# Altium project STM32 V3.1.PrjPcb
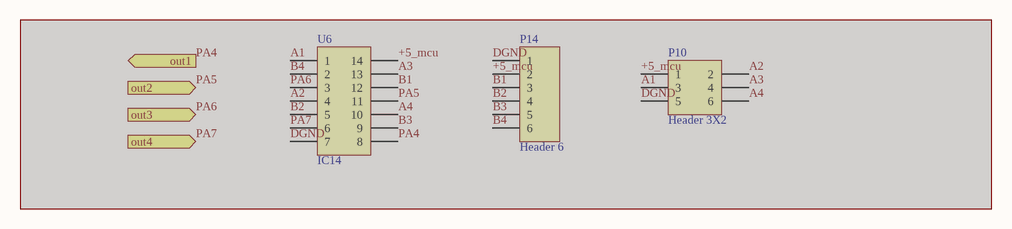
[diagram p0: Radio.SchDoc]
3 sheets, 98 parts. Net scope: hierarchical (ports join the sheet entries above them; power ports are global).
Board file: STM32 V3.1.PcbDoc
Sheets:
  Radio.SchDoc
  STM32 V3.1.SchDoc
    Designator = STLINK.SchDoc

## Sheet Radio.SchDoc
size A4

### Parts
(Parts that share a designator on the sheet are numbered #1, #2 ... from top to bottom, then left to right.)
P10#1  Header 3X2  [HDR2X3_]  (masked out: inside a compile mask, not in the netlist)
P14#1  Header 6  [HDR1X6]  (masked out: inside a compile mask, not in the netlist)
U6  IC14  [SOP_14]  (masked out: inside a compile mask, not in the netlist)

### Ports
out1 (out), out2 (out), out3 (out), out4 (out)

### Library data of the parts
P10#1 = Header 3X2: Header, 3-Pin, Dual row; LatestRevisionDate: 17-Jul-2002; LatestRevisionNote: Re-released for DXP Platform.; Publisher: Altium Limited
P14#1 = Header 6: Header, 6-Pin; LatestRevisionDate: 17-Jul-2002; LatestRevisionNote: Re-released for DXP Platform.; Publisher: Altium Limited
U6 = IC_14

## Sheet STM32 V3.1.SchDoc
size A4; Engineer: Csh; Address1: 巡游; project1: 巡游; project2: 最小系统; project3: 巡游; project4: 传感器
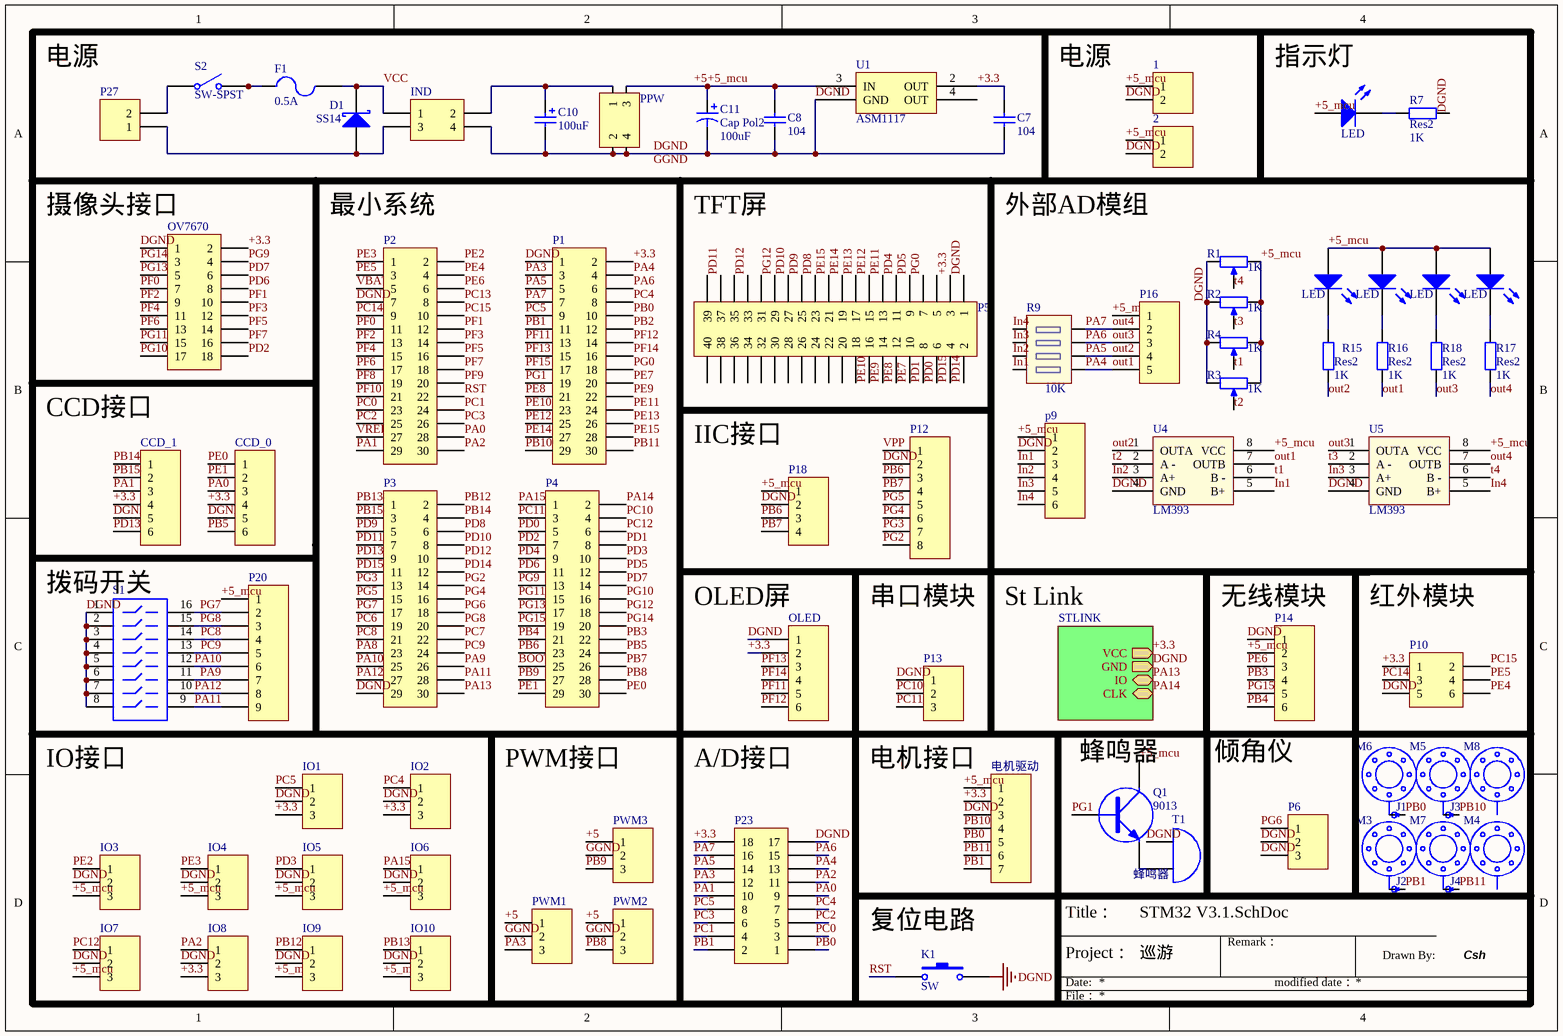
[diagram p1: STM32 V3.1.SchDoc]

### Parts
(Parts that share a designator on the sheet are numbered #1, #2 ... from top to bottom, then left to right.)
1  Header 2  [HDR1X2]  (value not drawn)
2  Header 2  [HDR1X2]  (value not drawn)
C7  value 104  [0805_cap]  (hidden comment: Cap)
C8  value 104  [0805_cap]  (hidden comment: Cap)
C10  value 100uF  [SMD-EC-F10]  (hidden comment: Cap Pol1)
C11  Cap Pol2  value 100uF  [SMD-EC-F6.3]
CCD_0  Header 6  [HDR1X6]  (value not drawn)
CCD_1  Header 6  [HDR1X6]  (value not drawn)
D1  Type: SS14  [SMA]  (hidden comment: D-Schottky)
F1  value 0.5A  [1206]  (hidden comment: Fuse)
IND  Header 2X2  [IND_R10]  (value not drawn)
IO1  Header 3  [HDR1X3]  (value not drawn)
IO2  Header 3  [HDR1X3]  (value not drawn)
IO3  Header 3  [HDR1X3]  (value not drawn)
IO4  Header 3  [HDR1X3]  (value not drawn)
IO5  Header 3  [HDR1X3]  (value not drawn)
IO6  Header 3  [HDR1X3]  (value not drawn)
IO7  Header 3  [HDR1X3]  (value not drawn)
IO8  Header 3  [HDR1X3]  (value not drawn)
IO9  Header 3  [HDR1X3]  (value not drawn)
IO10  Header 3  [HDR1X3]  (value not drawn)
J1  JUMP  [JUMP]  (value not drawn)
J2  JUMP  [JUMP]  (value not drawn)
J3  JUMP  [JUMP]  (value not drawn)
J4  JUMP  [JUMP]  (value not drawn)
K1  SW  [SW_6*6 _l]
LED1  LED  [0805_led]
LED2  LED  [0805_led]
LED3  LED  [0805_led]
LED4  LED  [0805_led]
LED5  LED  [0805_led]
M3  安装孔  [M3螺丝孔_1]  (value not drawn)
M4  安装孔  [M3螺丝孔]  (value not drawn)
M5  安装孔  [M3螺丝孔_1]  (value not drawn)
M6  安装孔  [M3螺丝孔_1]  (value not drawn)
M7  安装孔  [M3螺丝孔_1]  (value not drawn)
M8  安装孔  [M3螺丝孔]  (value not drawn)
OLED  Header 6  [HDR1X6_]  (value not drawn)
OV7670  Header 9X2  [IDC18]  (value not drawn)
P1  Header 15X2_  [HDR2X15_]  (value not drawn)
P2  Header 15X2_  [HDR2X15_]  (value not drawn)
P3  Header 15X2_  [HDR2X15_]  (value not drawn)
P4  Header 15X2_  [HDR2X15_]  (value not drawn)
P5  Header 20X2  [TFT_2.4]  (value not drawn)
P6  Header 3  (value not drawn)
p9  Header 6  [HDR1X6]  (value not drawn)
P10#2  Header 3X2  [HDR2X3_]  (value not drawn)
P12  Header 8  [HDR1X8_]  (value not drawn)
P13  Header 3  [HDR1X3_]  (value not drawn)
P14#2  Header 6  [HDR1X6]  (value not drawn)
P16  Header 5  [a05]  (value not drawn)
P18  Header 4  [HDR1X4]  (value not drawn)
P20  Header 9  [A09]  (value not drawn)
P23  Header 9X2  [JTAG_18]  (value not drawn)
P27  Header 2  [kf142r]  (value not drawn)
PPW  Header 2X2  [稳压模块]  (value not drawn)
PWM1  Header 3  [HDR1X3]  (value not drawn)
PWM2  Header 3  [HDR1X3]  (value not drawn)
PWM3  Header 3  [HDR1X3]  (value not drawn)
Q1  9013  [SOT_23_3]
R1#1  value 1K  [369-03]  (hidden comment: ResPot)
R2#1  value 1K  [369-03]  (hidden comment: ResPot)
R3  value 1K  [369-03]  (hidden comment: ResPot)
R4#1  value 1K  [369-03]  (hidden comment: ResPot)
R7  Res2  value 1K  [0805_res]
R9  10K  [0603_P]
R15  Res2  value 1K  [0805_res]
R16  Res2  value 1K  [0805_res]
R17  Res2  value 1K  [0805_res]
R18  Res2  value 1K  [0805_res]
S1  SW-DIP8  [SW_8WAY]  (value not drawn)
S2  SW-SPST  [SW-TO3]
T1  蜂鸣器  [蜂鸣器]
U1  ASM1117  [SOT_223]
U4  LM393  [SOP_8]
U5  LM393  [SOP_8]
电机驱动  Header 7  [HDR1X7]  (value not drawn)

### Sub-sheets
Designator = STLINK: VCC (out), GND (out), IO, CLK

### Nets
+3.3: C7.2 CCD_0.4 CCD_1.4 IO1.3 IO2.3 IO8.3 OLED.2 OV7670.2 P1.2 P5.3 P10#2.1 P23.18 U1.2(OUT) 电机驱动.2 ; sheet Designator/VCC
DGND: 1.2 2.2 C7.1 C8.1 C10.2 C11.2 CCD_0.5 CCD_1.5 IND.4 IO1.2 IO2.2 IO3.2 IO4.2 IO5.2 IO6.2 IO7.2 IO8.2 IO9.2 IO10.2 K1.2 OLED.1 OV7670.1 P1.1 P2.7 P3.29 P5.1 P6.2 P6.3 p9.2 P10#2.5 P12.2 P13.1 P14#2.1 P18.2 P23.17 PPW.2 PPW.4 R1#1.1(TOP) R2#1.1(TOP) R3.1(TOP) R4#1.1(TOP) R7.1 S1.1 S1.2 S1.3 S1.4 S1.5 S1.6 S1.7 S1.8 T1.2 U1.1(GND) U4.4(GND) U5.4(GND) 电机驱动.3 ; sheet Designator/GND
+5: 1.1 2.1 C8.2 C11.1 IO3.3 IO4.3 IO5.3 IO6.3 IO7.3 IO9.3 IO10.3 LED1.1 LED2.1 LED3.1 LED4.1 LED5.1 p9.1 P14#2.2 P16.1 P18.1 P20.1 PPW.3 PWM1.1 PWM2.1 PWM3.1 Q1.3(C) R1#1.2(BOT) R2#1.2(BOT) R3.2(BOT) R4#1.2(BOT) U1.3(IN) U4.8(VCC) U5.8(VCC) 电机驱动.1  [also labelled +5_mcu]
BOOT0: P4.25
GGND: PWM1.2 PWM2.2 PWM3.2
In1: p9.3 R9.4 U4.5(B+)
In2: p9.4 R9.3 U4.3(A+)
In3: p9.5 R9.2 U5.3(A+)
In4: p9.6 R9.1 U5.5(B+)
out1: P1.4 P16.5 P23.13 R9.5 R16.1 U4.7(OUTB)  [also labelled PA4]
out2: P1.5 P16.4 P23.14 R9.6 R15.1 U4.1(OUTA)  [also labelled PA5]
out3: P1.6 P16.3 P23.15 R9.7 R18.1 U5.1(OUTA)  [also labelled PA6]
out4: P1.7 P16.2 P23.16 R9.8 R17.1 U5.7(OUTB)  [also labelled PA7]
PA0: CCD_0.3 P2.28 P23.9
PA1: CCD_1.3 P2.29 P23.10
PA2: IO8.1 P2.30 P23.11
PA3: P1.3 P23.12 PWM1.3
PA8: P3.23
PA9: P3.26 P20.7 S1.11
PA10: P3.25 P20.6 S1.12
PA11: P3.28 P20.9 S1.9
PA12: P3.27 P20.8 S1.10
PA13: P3.30 ; sheet Designator/IO  [project net IO]
PA14: P4.2 ; sheet Designator/CLK  [project net CLK]
PA15: IO6.1 P4.1
PB0: J1.1 P1.10 P23.1 电机驱动.5
PB1: J2.1 P1.11 P23.2 电机驱动.7
PB2: P1.12
PB3: P4.22 P14#2.4
PB4: P4.21 P14#2.6
PB5: CCD_0.6 P4.24
PB6: P4.23 P12.3 P18.3
PB7: P4.26 P12.4 P18.4
PB8: P4.28 PWM2.3
PB9: P4.27 PWM3.3
PB10: J3.1 P1.29 电机驱动.4
PB11: J4.1 P1.30 电机驱动.6
PB12: IO9.1 P3.2
PB13: IO10.1 P3.1
PB14: CCD_1.1 P3.4
PB15: CCD_1.2 P3.3
PC0: P2.23 P23.3
PC1: P2.24 P23.4
PC2: P2.25 P23.5
PC3: P2.26 P23.6
PC4: IO2.1 P1.8 P23.7
PC5: IO1.1 P1.9 P23.8
PC6: P3.19
PC7: P3.22
PC8: P3.21 P20.4 S1.14
PC9: P3.24 P20.5 S1.13
PC10: P4.4 P13.2
PC11: P4.3 P13.3
PC12: IO7.1 P4.6
PC13: P2.8
PC14: P2.9 P10#2.3
PC15: P2.10 P10#2.2
PD0: P4.5 P5.6
PD1: P4.8 P5.8
PD2: OV7670.18 P4.7
PD3: IO5.1 P4.10
PD4: P4.9 P5.11
PD5: P4.12 P5.9
PD6: OV7670.8 P4.11
PD7: OV7670.6 P4.14
PD8: P3.6 P5.23
PD9: P3.5 P5.25
PD10: P3.8 P5.27
PD11: P3.7 P5.37
PD12: P3.10 P5.33
PD13: CCD_1.6 P3.9
PD14: P3.12 P5.2
PD15: P3.11 P5.4
PE0: CCD_0.1 P4.30
PE1: CCD_0.2 P4.29
PE2: IO3.1 P2.2
PE3: IO4.1 P2.1
PE4: P2.4 P10#2.6
PE5: P2.3 P10#2.4
PE6: P2.6 P14#2.3
PE7: P1.20 P5.10
PE8: P1.21 P5.12
PE9: P1.22 P5.14
PE10: P1.23 P5.16
PE11: P1.24 P5.13
PE12: P1.25 P5.15
PE13: P1.26 P5.17
PE14: P1.27 P5.19
PE15: P1.28 P5.21
PF0: OV7670.7 P2.11
PF1: OV7670.10 P2.12
PF2: OV7670.9 P2.13
PF3: OV7670.12 P2.14
PF4: OV7670.11 P2.15
PF5: OV7670.14 P2.16
PF6: OV7670.13 P2.17
PF7: OV7670.16 P2.18
PF8: P2.19
PF9: P2.20
PF10: P2.21
PF11: OLED.5 P1.13
PF12: OLED.6 P1.14
PF13: OLED.3 P1.15
PF14: OLED.4 P1.16
PF15: P1.17
PG0: P1.18 P5.7
PG1: P1.19 Q1.2(B)
PG2: P3.14 P12.8
PG3: P3.13 P12.7
PG4: P3.16 P12.6
PG5: P3.15 P12.5
PG6: P3.18 P6.1
PG7: P3.17 P20.2 S1.16
PG8: P3.20 P20.3 S1.15
PG9: OV7670.4 P4.13
PG10: OV7670.17 P4.16
PG11: OV7670.15 P4.15
PG12: P4.18 P5.29
PG13: OV7670.5 P4.17
PG14: OV7670.3 P4.20
PG15: P4.19 P14#2.5
RST: K1.1 P2.22
t1: R4#1.3(TAP) U4.6(B_-)
t2: R3.3(TAP) U4.2(A_-)
t3: R2#1.3(TAP) U5.2(A_-)
t4: R1#1.3(TAP) U5.6(B_-)
VBAT: P2.5
VCC: D1.2(K) F1.2 IND.1
VPP: P12.1
VREF+: P2.27
NetC10_1: C10.1 IND.2 PPW.1
NetD1_1: D1.1(A) IND.3 P27.1
NetF1_1: F1.1 S2.2(NO)
NetJ1_2: J1.2 M6.1(P)
NetJ2_2: J2.2 M3.1(P)
NetJ3_2: J3.2 M5.1(P)
NetJ4_2: J4.2 M7.1(P)
NetLED1_2: LED1.2 R7.2
NetLED2_2: LED2.2 R15.2
NetLED3_2: LED3.2 R17.2
NetLED4_2: LED4.2 R18.2
NetLED5_2: LED5.2 R16.2
NetP27_2: P27.2 S2.1(COMMON)
NetQ1_1: Q1.1(E) T1.1

Not connected (* = marked no-connect by the designer): M4 1(P); M8 1(P); P5 5 18 20 22 24 26 28 30 31 32 34 35 36 38 39 40; U1 4(OUT)

### Notes on the sheet
- 电源
- (near LED1) 指示灯
- 摄像头接口
- 最小系统
- TFT屏
- 外部AD模组
- CCD接口
- IIC接口
- (near S1) 拨码开关
- OLED屏
- (near P12) 串口模块
- St Link
- (near P14#2) 无线模块
- 红外模块
- (near S1) IO接口
- PWM接口
- A/D接口
- (near P13) 电机接口
- (near Q1) 蜂鸣器
- (near P14#2) 倾角仪
- (near K1) 复位电路
- Labels drawn without touching a wire or pin: GGND
- Title：
- Date:
- Project：
- Remark：
- modified date：
- Drawn By:
- File：

### Library data of the parts
1 2 P27 = Header 2: Header, 2-Pin; LatestRevisionDate: 17-Jul-2002; LatestRevisionNote: Re-released for DXP Platform.; Publisher: Altium Limited
C7 C8 = Cap: 无极性电容; Published: 8-Jun-2000; LatestRevisionDate: 17-Jul-2002; LatestRevisionNote: Re-released for DXP Platform.; PackageReference: RAD-0.3; Publisher: Altium Limited
C10 = Cap Pol1: Polarized Capacitor (Radial); Published: 8-Jun-2000; Revision: July-2002: Re-released for DXP Platform.; Publisher: Altium Limited
C11 = Cap Pol2: Polarized Capacitor (Axial); Published: 8-Jun-2000; Revision: July-2002: Re-released for DXP Platform.; Publisher: Altium Limited
CCD_0 CCD_1 OLED p9 P14#2 = Header 6: Header, 6-Pin; Publisher: Altium Limited
  CCD_0 CCD_1 P14#2: LatestRevisionDate: 17-Jul-2002; LatestRevisionNote: Re-released for DXP Platform.
  OLED p9: Revision: 17-Jul-2002: Re-released for DXP Platform.
D1 = D-Schottky: 肖特基二极管; Published: 8-Jun-2000; LatestRevisionDate: 17-Jul-2002; LatestRevisionNote: Re-released for DXP Platform.; PackageReference: SMB; Publisher: Altium Limited; Code_JEDEC: DO-214-AA
F1 = Fuse 2: 保险丝; Published: 8-Jun-2000; LatestRevisionDate: 17-Jul-2002; LatestRevisionNote: Re-released for DXP Platform.; PackageReference: PIN-W2/E2.8; Publisher: Altium Limited
IND PPW = Header 2X2: Header, 2-Pin, Dual row; LatestRevisionDate: 17-Jul-2002; LatestRevisionNote: Re-released for DXP Platform.; Publisher: Altium Limited
IO1-IO10 P6 P13 PWM1-PWM3 = Header 3: Header, 3-Pin; LatestRevisionDate: 17-Jul-2002; LatestRevisionNote: Re-released for DXP Platform.; Publisher: Altium Limited
LED1-LED5 = 发光二极管
M3-M8 = 安装孔: 螺丝固定孔
OV7670 P23 = Header 9X2: Header, 9-Pin, Dual row; LatestRevisionDate: 17-Jul-2002; LatestRevisionNote: Re-released for DXP Platform.; Publisher: Altium Limited
P1-P4 = Header 15X2: Header, 15-Pin, Dual row; LatestRevisionDate: 17-Jul-2002; LatestRevisionNote: Re-released for DXP Platform.; Publisher: Altium Limited
P5 = Header 20X2: Header, 20-Pin, Dual row; LatestRevisionDate: 17-Jul-2002; LatestRevisionNote: Re-released for DXP Platform.; Publisher: Altium Limited
P10#2 = Header 3X2: Header, 3-Pin, Dual row; LatestRevisionDate: 17-Jul-2002; LatestRevisionNote: Re-released for DXP Platform.; Publisher: Altium Limited
P12 = Header 8: Header, 8-Pin; LatestRevisionDate: 17-Jul-2002; LatestRevisionNote: Re-released for DXP Platform.; Publisher: Altium Limited
P16 = Header 5: Header, 5-Pin; LatestRevisionDate: 17-Jul-2002; LatestRevisionNote: Re-released for DXP Platform.; Publisher: Altium Limited
P18 = Header 4: Header, 4-Pin; LatestRevisionDate: 17-Jul-2002; LatestRevisionNote: Re-released for DXP Platform.; Publisher: Altium Limited
P20 = Header 9: Header, 9-Pin; LatestRevisionDate: 17-Jul-2002; LatestRevisionNote: Re-released for DXP Platform.; Publisher: Altium Limited
Q1 = NPN9013: pin to pad: 1>2 2>1
R1#1 R2#1 R3 R4#1 = ResPot: Potentiometer; Sim Note: Enter the Resistance value and the set point into parameter fields.; Set Position: 0.5; Published: 8-Jun-2000; LatestRevisionDate: 17-Jul-2002; LatestRevisionNote: Re-released for DXP Platform.; PackageReference: VR5; Publisher: Altium Limited
R7 R15-R18 = Res2: Resistor; Published: 8-Jun-2000; LatestRevisionDate: 17-Jul-2002; LatestRevisionNote: Re-released for DXP Platform.; PackageReference: AXIAL-0.4; Publisher: Altium Limited
R9 = 0603_P
S1 = SW-DIP8: 4009 Series DIP Switch, Raised actuator; Published: 24-Mar-1999; LatestRevisionDate: 17-Dec-2003; LatestRevisionNote: PCB Footprint replaced.; PackageReference: DIP-16-KEY; Publisher: Altium Limited; ComponentLink1Description: Manufacturer Link; ComponentLink1URL: http://www.oupiin.com/prodindx.html#Headers
S2 = SW-SPST: Single-Pole, Single-Throw Switch; pin to pad: 1>2 2>1; Published: 24-Mar-1999; Revision: July-2002: Re-released for DXP Platform.; Publisher: Altium Limited
U1 = ASM1117: 3.3V稳压芯片
电机驱动 = Header 7: Header, 7-Pin; LatestRevisionDate: 17-Jul-2002; LatestRevisionNote: Re-released for DXP Platform.; Publisher: Altium Limited

## Sheet STLINK.SchDoc
size A4; Engineer: Csh; Address1: 巡游; project1: 巡游; project2: 最小系统; project3: 巡游; project4: 传感器
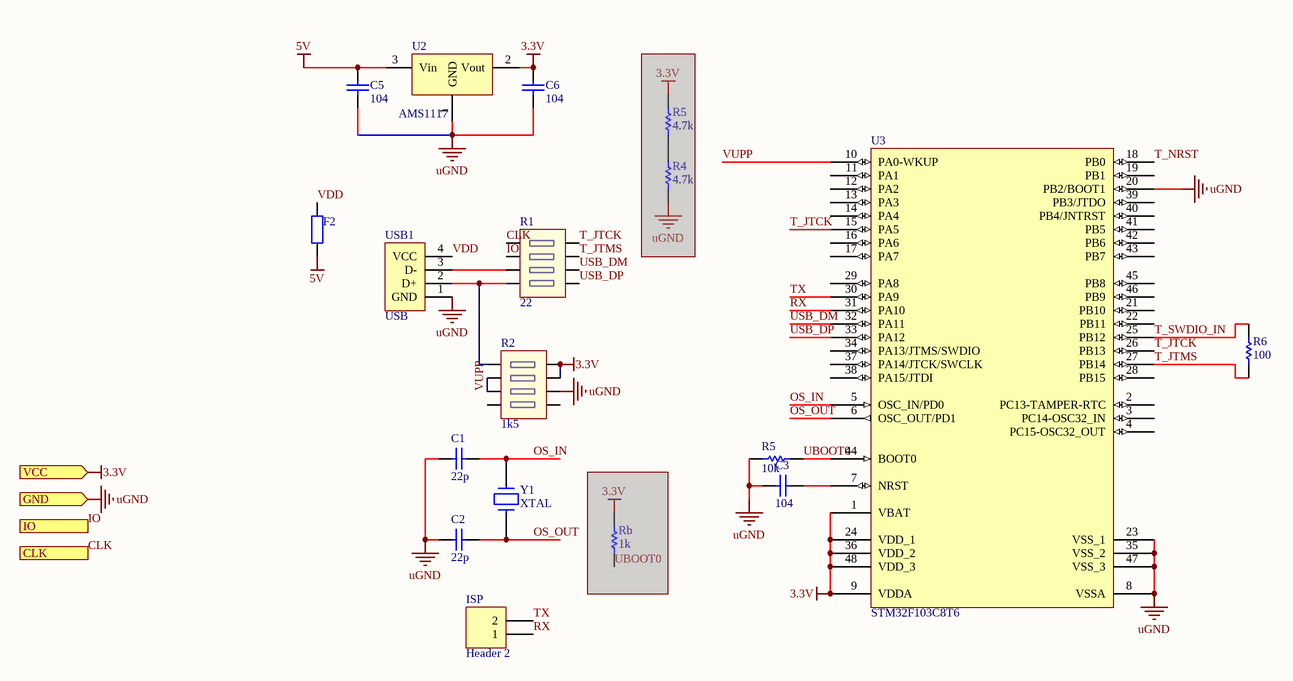
[diagram p2: STLINK.SchDoc]

### Parts
(Parts that share a designator on the sheet are numbered #1, #2 ... from top to bottom, then left to right.)
C1  value 22p  [0805_CAP]  (hidden comment: Cap)
C2  value 22p  [0805_CAP]  (hidden comment: Cap)
C3  value 104  [0805_CAP]  (hidden comment: Cap)
C5  value 104  [0805_CAP]  (hidden comment: Cap)
C6  value 104  [0805_CAP]  (hidden comment: Cap)
F2  Res2  [0805_RES]  (value not drawn)
ISP  Header 2  [HDR1X2]
R1#2  22  [0603_P]
R2#2  1k5  [0603_P]
R4#2  value 4.7k  [0603_RES]  (hidden comment: RES)  (masked out: inside a compile mask, not in the netlist)
R5#1  value 4.7k  [0603_RES]  (hidden comment: RES)  (masked out: inside a compile mask, not in the netlist)
R5#2  value 10k  [0805_RES]  (hidden comment: RES)
R6  value 100  [0805_RES]  (hidden comment: RES)
Rb  value 1k  [0805_RES]  (hidden comment: RES)  (masked out: inside a compile mask, not in the netlist)
U2  AMS1117  [SOT_223]
U3  STM32F103C8T6  [LQFP_48]
USB1  USB  [USB_B_M]
Y1  XTAL  [XTAL-RAD-0.2]

### Ports
CLK, GND, IO, VCC

### Nets
3.3V: C6.2 R2#2.7 R2#2.8 U2.2(Vout) U3.1(VBAT) U3.9(VDDA) U3.24(VDD_1) U3.36(VDD_2) U3.48(VDD_3) ; port VCC  [project net +3.3]
5V: C5.2 F2.2 U2.3(Vin)
uGND: C1.1 C2.1 C3.1 C5.1 C6.1 R2#2.6 R5#2.1 U2.1(GND) U3.8(VSSA) U3.20(PB2/BOOT1) U3.23(VSS_1) U3.35(VSS_2) U3.47(VSS_3) USB1.1(GND) ; port GND  [project net DGND]
CLK: R1#2.1 ; port CLK
IO: R1#2.2 ; port IO
OS_IN: C1.2 U3.5(OSC_IN/PD0) Y1.2
OS_OUT: C2.2 U3.6(OSC_OUT/PD1) Y1.1
RX: ISP.1 U3.31(PA10)
T_JTCK: R1#2.8 U3.15(PA5) U3.26(PB13)
T_JTMS: R1#2.7 R6.1 U3.27(PB14)
T_NRST: U3.18(PB0)
T_SWDIO_IN: R6.2 U3.25(PB12)
TX: ISP.2 U3.30(PA9)
UBOOT0: R5#2.2 U3.44(BOOT0)
USB_DM: R1#2.6 U3.32(PA11)
USB_DP: R1#2.5 U3.33(PA12)
VDD: F2.1 USB1.4(VCC)
VUPP: R2#2.2 R2#2.3 U3.10(PA0-WKUP)
NetC3_2: C3.2 U3.7(NRST)
NetR1#2_3: R1#2.3 USB1.3(D-)
NetR1#2_4: R1#2.4 R2#2.1 USB1.2(D+)

Not connected (* = marked no-connect by the designer): R2#2 4 5; U3 2(PC13-TAMPER-RTC) 3(PC14-OSC32_IN) 4(PC15-OSC32_OUT) 11(PA1) 12(PA2) 13(PA3) 14(PA4) 16(PA6) 17(PA7) 19(PB1) 21(PB10) 22(PB11) 28(PB15) 29(PA8) 34(PA13/JTMS/SWDIO) 37(PA14/JTCK/SWCLK) 38(PA15/JTDI) 39(PB3/JTDO) 40(PB4/JNTRST) 41(PB5) 42(PB6) 43(PB7) 45(PB8) 46(PB9)

### Notes on the sheet
- Title：
- Date:
- Project：
- Remark：
- modified date：
- Drawn By:
- File：

### Library data of the parts
F2 = Res2: Resistor; Value: 1K; Published: 8-Jun-2000; LatestRevisionDate: 17-Jul-2002; LatestRevisionNote: Re-released for DXP Platform.; PackageReference: AXIAL-0.4; Publisher: Altium Limited
ISP = Header 2: Header, 2-Pin; LatestRevisionDate: 17-Jul-2002; LatestRevisionNote: Re-released for DXP Platform.; Publisher: Altium Limited
R1#2 R2#2 = 0603P
U2 = AMS1117: 3.3V电压转换器AMS1117
U3 = STM32F103C8T6: STM32 ARM-based 32-bit MCU with 64 Kbytes Flash, 48-pin LQFP, Industrial Temperature; Published: 30-May-2008; DatasheetVersion: rev6, Mar-2008; PackageVersion: Mar-2008; PackageReference: LQFP48; Publisher: Altium Limited; PackageDescription: 48-Pin Low-Profile Quad Flat Pack, 7 x 7 mm Body, 0.5 mm Pitch (LQFP48); ComponentLink1Description: Manufacturer Link; ComponentLink1URL: www.st.com/stm32; ComponentLink2Description: Datasheet; ComponentLink2URL: http://www.st.com/stonline/products/literature/ds/13587.pdf
USB1 = USB_G: pin to pad: 1>4 2>3 3>2 4>1

## Nets that join several sheets
+3.3: STM32 V3.1 (14 pins), STLINK (9 pins)
DGND: STM32 V3.1 (55 pins), STLINK (14 pins)
CLK: STM32 V3.1 (P4.2), STLINK (R1#2.1)
IO: STM32 V3.1 (P3.30), STLINK (R1#2.2)